# Altium schematic sheet Motor Interface - Pre-Charge Interface.SchDoc: Motor Interface - PreCharge Interface
size B; Organization: Midnight Sun Solar Rayce Car Team; Address1: University of Waterloo; Address2: 200 University Ave W; Address3: Waterloo, ON, Canada; Address4: N2L 3E9; DocumentNumber: 4; SheetNumber: 4; SheetTotal: 6; Website: www.uwmidsun.com
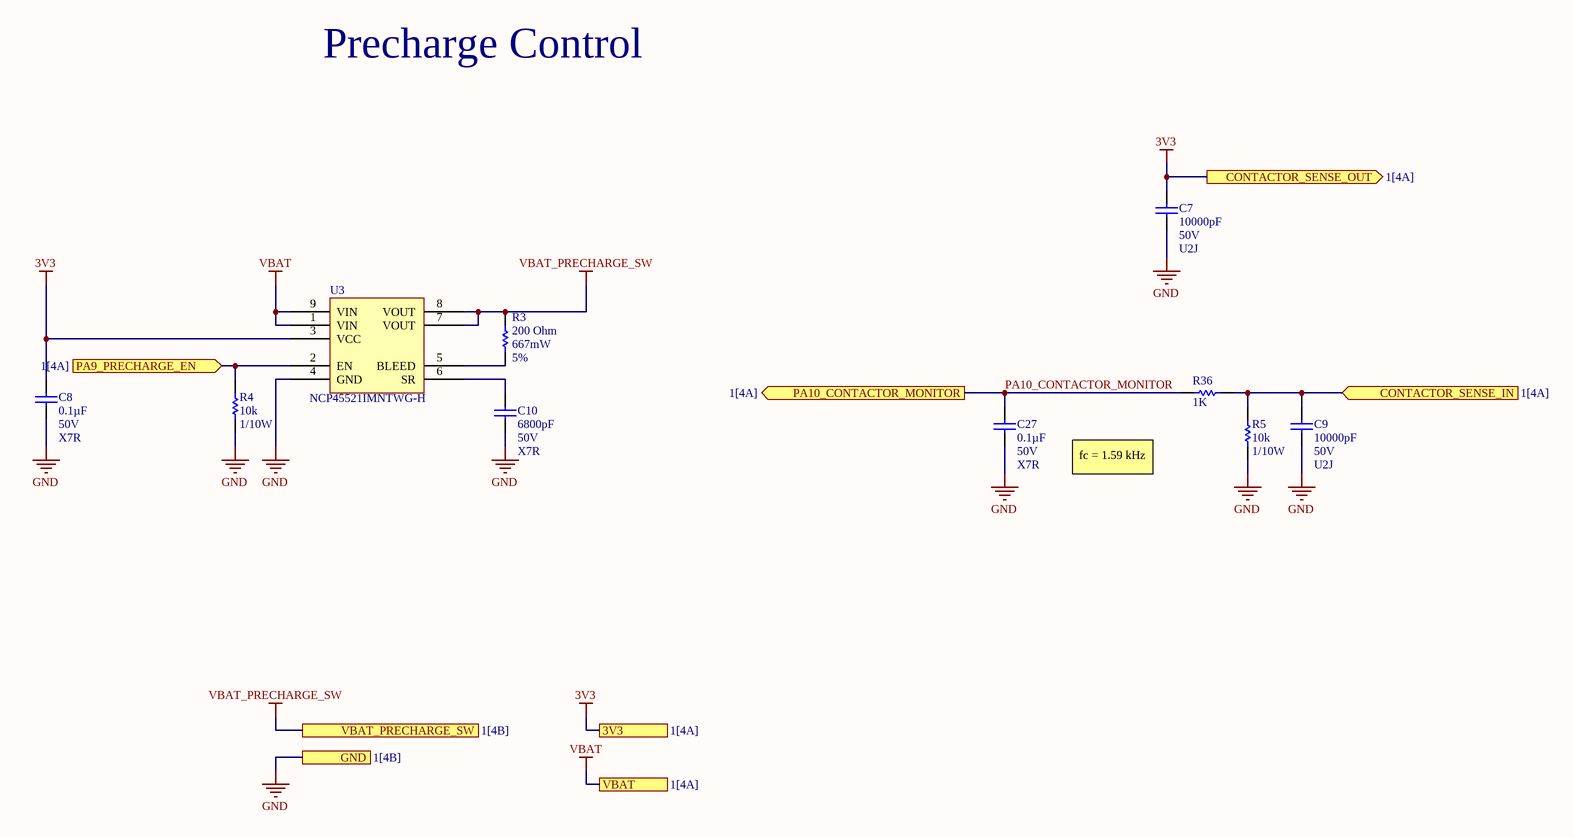
[diagram p0: Motor Interface - Pre-Charge Interface.SchDoc]

## Parts
C7  Capacitance: 10000pF  Voltage: 50V  Temperature Coefficient: U2J  [CAP, 0603]  (hidden comment: CAP CER 10nF 50V 5% X7R 0603)
C8  Capacitance: 0.1µF  Voltage: 50V  Temperature Coefficient: X7R  [CAP, 0603]  (hidden comment: CAP CER 0.1UF 50V 10% X7R 0603)
C9  Capacitance: 10000pF  Voltage: 50V  Temperature Coefficient: U2J  [CAP, 0603]  (hidden comment: CAP CER 10nF 50V 5% X7R 0603)
C10  Capacitance: 6800pF  Voltage: 50V  Temperature Coefficient: X7R  [CAP, 0603]  (hidden comment: CAP CER 6800pF 50V 10% X7R 0603)
C27  Capacitance: 0.1µF  Voltage: 50V  Temperature Coefficient: X7R  [CAP, 0603]  (hidden comment: CAP CER 0.1UF 50V 10% X7R 0603)
R3  200 Ohm  Tolerance: 5%  Max Power Dissipation: 667mW  [RES 1206]
R4  Resistance: 10k  Power: 1/10W  [RES, 0603]  (hidden comment: RES 10K OHM 1% 1/10W 0603)
R5  Resistance: 10k  Power: 1/10W  [RES, 0603]  (hidden comment: RES 10K OHM 1% 1/10W 0603)
R36  1K  [RES, 0603]
U3  IC LOAD SWITCH ACT-HI 10.5A 8DFN  [IC LOAD SWITCH ACT-HI 10.5A 8DFN]  (value not drawn)

## Ports
3V3 (see 1[4A]), CONTACTOR_SENSE_IN (in, see 1[4A]), CONTACTOR_SENSE_OUT (out, see 1[4A]), GND (see 1[4B]), PA9_PRECHARGE_EN (in, see 1[4A]), PA10_CONTACTOR_MONITOR (out, see 1[4A]), VBAT (see 1[4A]), VBAT_PRECHARGE_SW (see 1[4B])

## Nets
3V3: C7.1 C8.1 U3.3(VCC) ; port CONTACTOR_SENSE_OUT, port 3V3
GND: C7.2 C8.2 C9.2 C10.2 C27.2 R4.2 R5.2 U3.4(GND) ; port GND
VBAT: U3.1(VIN) U3.9(VIN) ; port VBAT
VBAT_PRECHARGE_SW: R3.1 U3.7(VOUT) U3.8(VOUT) ; port VBAT_PRECHARGE_SW
CONTACTOR_SENSE_IN: C9.1 R5.1 R36.2 ; port CONTACTOR_SENSE_IN
PA9_PRECHARGE_EN: R4.1 U3.2(EN) ; port PA9_PRECHARGE_EN
PA10_CONTACTOR_MONITOR: C27.1 R36.1 ; port PA10_CONTACTOR_MONITOR
NetC10_1: C10.1 U3.6(SR)
NetR3_2: R3.2 U3.5(BLEED)

## Notes on the sheet
- Precharge Control
- fc = 1.59 kHz
- PROJECT
- DOCUMENT
- DRAWN BY
- LAST MODIFIED
- PART NUMBER
- REVISION
- SHEET
- VARIANT
- OF
- Engineering 5 - 1002
  University of Waterloo
  (519) 888-4567 x32978
  hardware@uwmidsun.com

## Library data of the parts
C7 C9 = CAP CER 10nF 50V 5% X7R 0603: 10000pF ±5% 50V Ceramic Capacitor U2J 0603 (1608 Metric); Manufacturer 1: KEMET; Manufacturer Part Number 1: C0603C103J5JAC7867; Supplier 1: Digi-Key; Supplier Part Number 1: 399-13384-1-ND; Packaging: Cut Tape (CT); Part Status: Active; Operating Temperature: -55°C ~ 125°C; Ratings: -; Failure Rate: -; Mounting Type: Surface Mount, MLCC; Package / Case: 0603 (1608 Metric); Size / Dimension: 0.063" L x 0.032" W (1.60mm x 0.80mm); Height - Seated (Max): -; Thickness (Max): 0.034" (0.87mm); Lead Spacing: -; Lead Style: -; ComponentLink1URL: http://www.kemet.com/docfinder?Partnumber=C0603C103J5JAC7867; ComponentLink1Description: http://www.kemet.com/docfinder?Partnumber=C0603C103J5JAC7867; Tolerance: ±5%
C8 C27 = CAP CER 0.1UF 50V 10% X7R 0603: 0.10µF ±10% 50V Ceramic Capacitor X7R 0603 (1608 Metric); Manufacturer 1: AVX Corporation; Manufacturer Part Number 1: 06035C104KAT2A; Supplier 1: Digi-Key; Supplier Part Number 1: 478-5052-1-ND; Packaging: Cut Tape (CT); Part Status: Active; Operating Temperature: -55°C ~ 125°C; Ratings: -; Mounting Type: Surface Mount, MLCC; Package / Case: 0603 (1608 Metric); Size / Dimension: 0.063" L x 0.032" W (1.60mm x 0.81mm); Height - Seated (Max): -; Thickness (Max): 0.035" (0.90mm); Lead Spacing: -; Lead Style: -; ComponentLink1URL: http://datasheets.avx.com/X7RDielectric.pdf; ComponentLink1Description: http://datasheets.avx.com/X7RDielectric.pdf; Tolerance: ±10%
C10 = CAP CER 6800pF 50V 10% X7R 0603: 6800pF ±10% 50V Ceramic Capacitor X7R 0603 (1608 Metric); Manufacturer 1: Samsung Electro-Mechanics America, Inc.; Manufacturer Part Number 1: CL10B682KB8SFNC; Supplier 1: Digi-Key; Supplier Part Number 1: 1276-2103-1-ND; Packaging: Cut Tape (CT); Part Status: Active; Operating Temperature: -55°C ~ 125°C; Ratings: -; Mounting Type: Surface Mount, MLCC; Package / Case: 0603 (1608 Metric); Size / Dimension: 0.063" L x 0.031" W (1.60mm x 0.80mm); Height - Seated (Max): -; Thickness (Max): 0.035" (0.90mm); Lead Spacing: -; Lead Style: -; ComponentLink1URL: http://www.samsungsem.com/kr/support/product-search/mlcc/CL10B682KB8SFNC.jsp; ComponentLink1Description: http://www.samsungsem.com/kr/support/product-search/mlcc/CL10B682KB8SFNC.jsp; Tolerance: ±10%
R3 = RES 200 OHM 5% 2/3W 1206: 200 Ohms ±5% 0.667W, 2/3W Chip Resistor 1206 (3216 Metric) Automotive AEC-Q200, Pulse Withstanding Thick Film; Manufacturer: Panasonic; Manufacturer Part Number: ERJ-P08J201V; Voltage Rating: 500V; Resistance: 200R; Power Rating: 660mW; Temperature Coefficient: 200ppm/°C; Voltage Rating (DC): 200V; Supplier 1: Digi-Key; Stock 1: 32165; Pricing 1: 1=0.16, 10=0.137, 100=0.0534, 1000=0.02237, 2500=0.02051 (USD); Mount: Surface Mount; Case/Package: 1206; Case Code (Imperial): 1206; Case Code (Metric): 3216; Contact Plating: Tin; Min Operating Temperature: -55°C; Max Operating Temperature: 155°C; Packaging: Tape and Reel; Package Quantity: 1; Termination: SMD/SMT; Composition: Thick Film; Number of Terminations: 2; Length: 3.2mm; Height: 0.028inch; Width: 1.6mm; Radiation Hardening: No; Lead Free: Contains Lead; ComponentLink1URL: https://datasheet.ciiva.com/17207/aoa0000ce4-17207029.pdf; ComponentLink1Description: https://datasheet.ciiva.com/17207/aoa0000ce4-17207029.pdf; ComponentLink2URL: https://datasheet.ciiva.com/9184/aoa0000ce4-9184599.pdf; ComponentLink2Description: https://datasheet.ciiva.com/9184/aoa0000ce4-9184599.pdf; ComponentLink3URL: https://datasheet.ciiva.com/9184/aoa0000ce4-9184603.pdf; ComponentLink3Description: https://datasheet.ciiva.com/9184/aoa0000ce4-9184603.pdf; ComponentLink4URL: https://datasheet.ciiva.com/30201/aoa0000ce4-30201485.pdf; ComponentLink4Description: https://datasheet.ciiva.com/30201/aoa0000ce4-30201485.pdf; Supplier Part Number 1: P200ALCT-ND
R4 R5 = RES 10K OHM 1% 1/10W 0603: RES SMD 10K OHM 1% 1/10W 0603; Manufacturer 1: Yageo; Manufacturer Part Number 1: RC0603FR-0710KL; Temperature Coefficient: ±100ppm/°C; Supplier 1: Digi-Key; Supplier Part Number 1: 311-10.0KHRCT-ND; Packaging: Cut Tape (CT); Part Status: Active; Composition: Thick Film; Operating Temperature: -55°C ~ 155°C; Package / Case: 0603 (1608 Metric); Supplier Device Package: 0603; Size / Dimension: 0.063" L x 0.031" W (1.60mm x 0.80mm); Height - Seated (Max): 0.022" (0.55mm); Failure Rate: -; ComponentLink1URL: http://www.yageo.com/documents/recent/PYu-RC_Group_51_RoHS_L_7.pdf; ComponentLink1Description: http://www.yageo.com/documents/recent/PYu-RC_Group_51_RoHS_L_7.pdf; Tolerance: ±1%
R36 = RES 1K OHM 5% 1/10W 0603: 1k Ohm ±5% 0.1W, 1/10W Chip Resistor 0603 (1608 Metric); Manufacturer: Yageo; Manufacturer Part Number: RC0603JR-071KL; Temperature Coefficient: ±100ppm/°C; Supplier 1: Digi-Key; Supplier Part Number 1: 311-1.0KGRCT-ND; RoHS: RoHS Compliant; Category: Resistors; Stock 1: 4415240; Pricing 1: 1=0.15, 10=0.017, 100=0.0071, 1000=0.0032, 2500=0.00278 (CAD); Packaging: Cut Tape (CT); Part Status: Active; Resistance (Ohms): 1k; Tolerance: ±5%; Power (Watts): 0.1W, 1/10W; Composition: Thick Film; Features: Moisture Resistant; Operating Temperature: -55°C ~ 155°C; Package / Case: 0603 (1608 Metric); Supplier Device Package: 0603; Size / Dimension: 0.063" L x 0.031" W (1.60mm x 0.80mm); Height - Seated (Max): 0.022" (0.55mm); Failure Rate: -; ComponentLink1URL: http://www.yageo.com/documents/recent/PYu-RC_Group_51_RoHS_L_7.pdf; ComponentLink1Description: http://www.yageo.com/documents/recent/PYu-RC_Group_51_RoHS_L_7.pdf
U3 = IC LOAD SWITCH ACT-HI 10.5A 8DFN: NCP45521IMNTWG-H; Manufacturer: ON Semiconductor; Switch Type: General Purpose; Number of Outputs: 1; Ratio - Input:Output: 1:1; Output Configuration: High Side; Output Type: N-Channel; Interface: On/Off; Voltage - Load: 0.5 V ~ 13.5 V; Voltage - Supply (Vcc/Vdd): 3 V ~ 5.5 V; Rds On (Typ): 12.8 mOhm; Input Type: Non-Inverting; Fault Protection: Over Temperature, UVLO; Manufacturer Part Number: NCP45521IMNTWG-H; RoHS: RoHS Compliant; Category: Integrated Circuits (ICs); Packaging: Digi-Reel®; Part Status: Active; Current - Output (Max): 10.5A; Features: Slew Rate Controlled; Operating Temperature: -40°C ~ 85°C (TA); Package / Case: 8-VFDFN Exposed Pad; Supplier Device Package: 8-DFN (2x2); ComponentLink1URL: http://www.onsemi.com/pub/Collateral/NCP45520-D.PDF; ComponentLink1Description: http://www.onsemi.com/pub/Collateral/NCP45520-D.PDF; Supplier 1: Digi-Key; Stock 1: 2377; Pricing 1: 1=1.57, 10=1.405, 100=1.0957, 500=0.90518, 1000=0.71462 (CAD); Supplier 2: Digi-Key; Stock 2: 2211; Pricing 2: 1=1.53, 10=1.372, 100=1.0702, 500=0.88408, 1000=0.69797 (CAD); Supplier Part Number 2: NCP45521IMNTWG-HOSDKR-ND